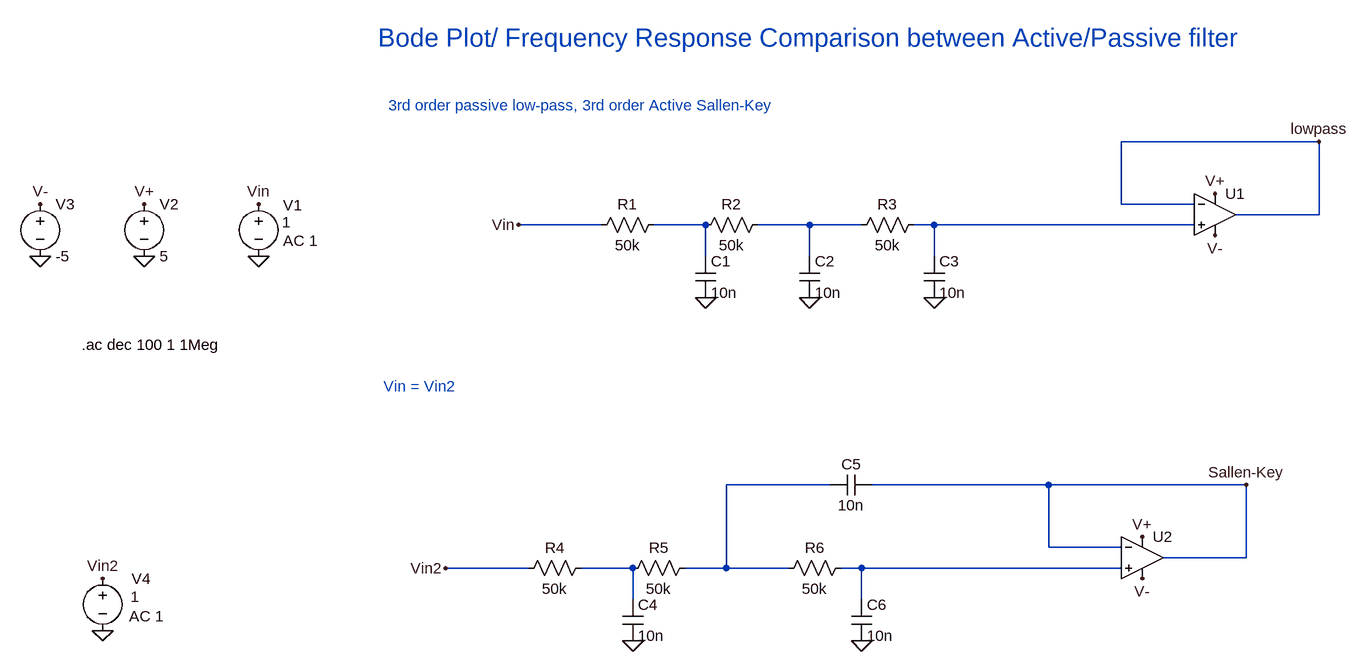
[diagram p0: schematic Sallen-Key_LowPass_ActiveVsPassive.asc]
Sallen-Key_LowPass_ActiveVsPassive.asc, the LTspice schematic file:
Version 4.1
SHEET 1 2584 884
WIRE 1328 96 1024 96
WIRE 1024 192 1024 96
WIRE 1136 192 1024 192
WIRE 1328 208 1328 96
WIRE 1328 208 1200 208
WIRE 224 224 96 224
WIRE 384 224 304 224
WIRE 544 224 464 224
WIRE 624 224 544 224
WIRE 736 224 704 224
WIRE 1136 224 736 224
WIRE 384 272 384 224
WIRE 544 272 544 224
WIRE 736 272 736 224
WIRE 576 624 416 624
WIRE 912 624 640 624
WIRE 1216 624 912 624
WIRE 912 720 912 624
WIRE 1024 720 912 720
WIRE 1216 736 1216 624
WIRE 1216 736 1088 736
WIRE 112 752 -16 752
WIRE 272 752 192 752
WIRE 416 752 416 624
WIRE 416 752 352 752
WIRE 512 752 416 752
WIRE 624 752 592 752
WIRE 1024 752 624 752
WIRE 272 800 272 752
WIRE 624 800 624 752
FLAG -304 272 0
FLAG -304 192 Vin
FLAG -480 272 0
FLAG -480 192 V+
FLAG -640 272 0
FLAG -640 192 V-
FLAG 1168 176 V+
FLAG 1168 240 V-
FLAG 384 336 0
FLAG 544 336 0
FLAG 736 336 0
FLAG 1056 704 V+
FLAG 1056 768 V-
FLAG 96 224 Vin
FLAG 272 864 0
FLAG 624 864 0
FLAG -544 848 0
FLAG -544 768 Vin2
FLAG -16 752 Vin2
FLAG 1216 624 Sallen-Key
FLAG 1328 96 lowpass
SYMBOL voltage -304 176 R0
WINDOW 123 38 72 Left 2
WINDOW 39 0 0 Left 0
WINDOW 0 38 18 Left 2
WINDOW 3 36 44 Left 2
SYMATTR Value2 AC 1
SYMATTR InstName V1
SYMATTR Value 1
SYMBOL OpAmps\\UniversalOpAmp2 1168 208 R0
SYMATTR InstName U1
SYMBOL voltage -480 176 R0
WINDOW 123 0 0 Left 0
WINDOW 39 0 0 Left 0
SYMATTR InstName V2
SYMATTR Value 5
SYMBOL voltage -640 176 R0
WINDOW 123 0 0 Left 0
WINDOW 39 0 0 Left 0
SYMATTR InstName V3
SYMATTR Value -5
SYMBOL res 320 208 R90
WINDOW 0 0 56 VBottom 2
WINDOW 3 32 56 VTop 2
SYMATTR InstName R1
SYMATTR Value 50k
SYMBOL cap 368 272 R0
SYMATTR InstName C1
SYMATTR Value 10n
SYMBOL res 480 208 R90
WINDOW 0 0 56 VBottom 2
WINDOW 3 32 56 VTop 2
SYMATTR InstName R2
SYMATTR Value 50k
SYMBOL cap 528 272 R0
SYMATTR InstName C2
SYMATTR Value 10n
SYMBOL cap 720 272 R0
SYMATTR InstName C3
SYMATTR Value 10n
SYMBOL res 720 208 R90
WINDOW 0 0 56 VBottom 2
WINDOW 3 32 56 VTop 2
SYMATTR InstName R3
SYMATTR Value 50k
SYMBOL OpAmps\\UniversalOpAmp2 1056 736 R0
SYMATTR InstName U2
SYMBOL res 208 736 R90
WINDOW 0 0 56 VBottom 2
WINDOW 3 32 56 VTop 2
SYMATTR InstName R4
SYMATTR Value 50k
SYMBOL cap 256 800 R0
SYMATTR InstName C4
SYMATTR Value 10n
SYMBOL res 368 736 R90
WINDOW 0 0 56 VBottom 2
WINDOW 3 32 56 VTop 2
SYMATTR InstName R5
SYMATTR Value 50k
SYMBOL cap 608 800 R0
SYMATTR InstName C6
SYMATTR Value 10n
SYMBOL res 608 736 R90
WINDOW 0 0 56 VBottom 2
WINDOW 3 32 56 VTop 2
SYMATTR InstName R6
SYMATTR Value 50k
SYMBOL cap 640 608 R90
WINDOW 0 0 32 VBottom 2
WINDOW 3 32 32 VTop 2
SYMATTR InstName C5
SYMATTR Value 10n
SYMBOL voltage -544 752 R0
WINDOW 123 41 74 Left 2
WINDOW 39 0 0 Left 0
WINDOW 0 45 16 Left 2
WINDOW 3 43 44 Left 2
SYMATTR Value2 AC 1
SYMATTR InstName V4
SYMATTR Value 1
TEXT -576 408 Left 2 !.ac dec 100 1 1Meg
TEXT -112 472 Left 2 ;Vin = Vin2
TEXT -120 -64 Left 4 ;Bode Plot/ Frequency Response Comparison between Active/Passive filter
TEXT -104 40 Left 2 ;3rd order passive low-pass, 3rd order Active Sallen-Key

The netlist it stands for:
* Sallen-Key_LowPass_ActiveVsPassive.asc
V1 Vin 0 1 AC 1
X§U1 N003 lowpass V+ V- lowpass level2 Avol=1Meg GBW=10Meg Slew=10Meg Ilimit=25m Rail=0 Vos=0 En=0 Enk=0 In=0 Ink=0 Rin=500Meg  ; pins In+ In- V+ V- OUT
V2 V+ 0 5
V3 V- 0 -5
R1 N001 Vin 50k
C1 N001 0 10n
R2 N002 N001 50k
C2 N002 0 10n
C3 N003 0 10n
R3 N003 N002 50k
X§U2 N006 Sallen-Key V+ V- Sallen-Key level2 Avol=1Meg GBW=10Meg Slew=10Meg Ilimit=25m Rail=0 Vos=0 En=0 Enk=0 In=0 Ink=0 Rin=500Meg  ; pins In+ In- V+ V- OUT
R4 N005 Vin2 50k
C4 N005 0 10n
R5 N004 N005 50k
C6 N006 0 10n
R6 N006 N004 50k
C5 Sallen-Key N004 10n
V4 Vin2 0 1 AC 1
.ac dec 100 1 1Meg
* Vin = Vin2
* Bode Plot/ Frequency Response Comparison between Active/Passive filter
* 3rd order passive low-pass, 3rd order Active Sallen-Key
.lib UniversalOpAmp2.lib
.backanno
.end